# Altium project BRZ_LightLink.PrjPcb
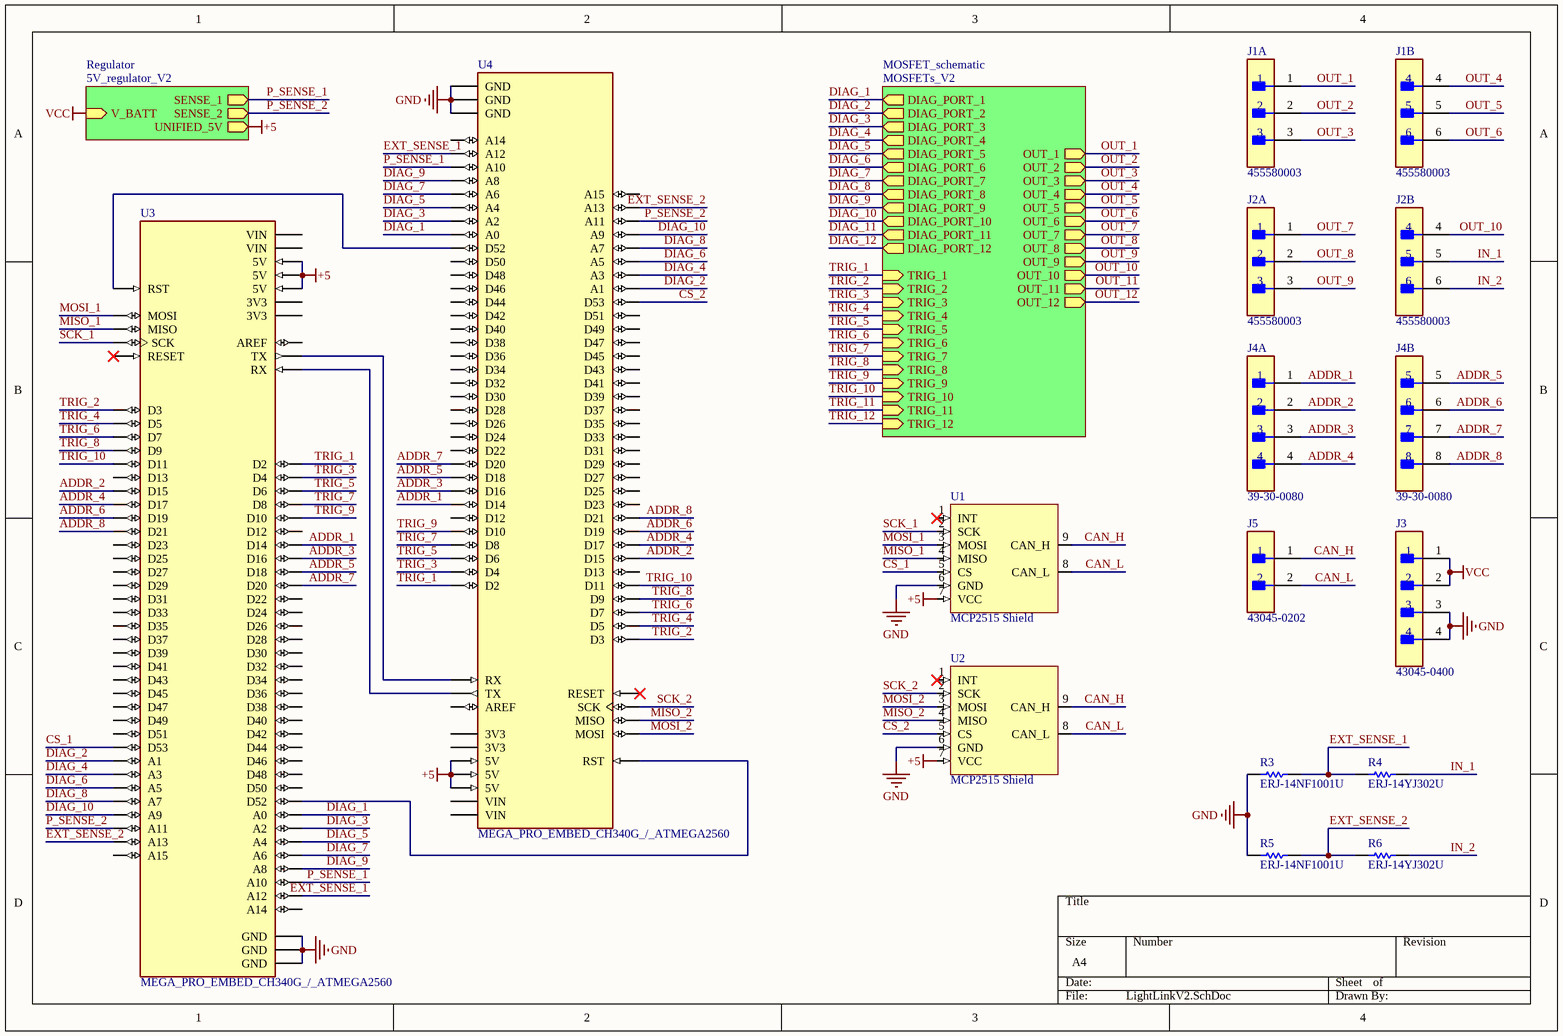
[diagram p0: LightLinkV2.SchDoc]
4 sheets, 136 parts. Net scope: hierarchical (ports join the sheet entries above them; power ports are global).
Board files: LightLinkV2.PcbDoc, LightLinkV2.1.PcbDoc, LightLinkV2.2.PcbDoc, LightLinkV3.0.PcbDoc
Sheets:
  LightLinkV2.SchDoc
    MOSFET_schematic = MOSFETs_V2.SchDoc
      Designator = MOSFET_V2.SchDoc
      Designator = MOSFET_V2.SchDoc
      Designator = MOSFET_V2.SchDoc
      Designator = MOSFET_V2.SchDoc
      Designator = MOSFET_V2.SchDoc
      Designator = MOSFET_V2.SchDoc
      Designator = MOSFET_V2.SchDoc
      Designator = MOSFET_V2.SchDoc
      Designator = MOSFET_V2.SchDoc
      Designator = MOSFET_V2.SchDoc
      Designator = MOSFET_V2.SchDoc
      Designator = MOSFET_V2.SchDoc
    Regulator = 5V_regulator_V2.SchDoc

## Sheet LightLinkV2.SchDoc
size A4; SheetNumber: 1; SheetTotal: 4

### Parts
J1  455580003  [FP-455580003-MFG]  (parts A,B of 2)
J2  455580003  [FP-455580003-MFG]  (parts A,B of 2)
J3  43045-0400  [FP-43045-0400-MFG]
J4  39-30-0080  [FP-39-30-0080-MFG]  (parts A,B of 2)
J5  43045-0202  [FP-43045-0202-MFG]
R3  ERJ-14NF1001U  [RESC3225X70X50NL20T20]
R4  ERJ-14YJ302U  [RESC3225X70X50NL20T20]
R5  ERJ-14NF1001U  [RESC3225X70X50NL20T20]
R6  ERJ-14YJ302U  [RESC3225X70X50NL20T20]
U1  MCP2515 Shield  [MCP2515 Shield-Footprint-1]
U2  MCP2515 Shield  [MCP2515 Shield-Footprint-1]
U3  MEGA_PRO_EMBED_CH340G_/_ATMEGA2560  [MODULE_MEGA_PRO_EMBED_CH340G_/_ATMEGA2560]
U4  MEGA_PRO_EMBED_CH340G_/_ATMEGA2560  [MODULE_MEGA_PRO_EMBED_CH340G_/_ATMEGA2560]

### Sub-sheets
MOSFET_schematic = MOSFETs_V2: DIAG_PORT_1 (out), TRIG_1 (in), DIAG_PORT_2 (out), TRIG_2 (in), DIAG_PORT_3 (out), TRIG_3 (in), DIAG_PORT_4 (out), TRIG_4 (in), OUT_4 (out), OUT_3 (out), OUT_2 (out), OUT_1 (out), DIAG_PORT_5 (out), TRIG_5 (in), DIAG_PORT_6 (out), TRIG_6 (in), DIAG_PORT_7 (out), TRIG_7 (in), DIAG_PORT_8 (out), TRIG_8 (in), OUT_8 (out), OUT_7 (out), OUT_6 (out), OUT_5 (out), DIAG_PORT_9 (out), TRIG_9 (in), OUT_9 (out), DIAG_PORT_10 (out), TRIG_10 (in), OUT_10 (out), DIAG_PORT_11 (out), TRIG_11 (in), DIAG_PORT_12 (out), TRIG_12 (in), OUT_11 (out), OUT_12 (out)
Regulator = 5V_regulator_V2: UNIFIED_5V (out), V_BATT (in), SENSE_1 (out), SENSE_2 (out)

### Nets
+5: U1.7(VCC) U2.7(VCC) U3.5V_1(5V) U3.5V_2(5V) U3.5V_3(5V) U4.5V_1(5V) U4.5V_2(5V) U4.5V_3(5V) ; sheet Regulator/UNIFIED_5V  [project net 5V_BUS_REGULATOR]
GND: J3.3 J3.4 R3.1 R5.1 U1.6(GND) U2.6(GND) U3.GND_1(GND) U3.GND_2(GND) U3.GND_3(GND) U4.GND_1(GND) U4.GND_2(GND) U4.GND_3(GND)
VCC: J3.1 J3.2 ; sheet Regulator/V_BATT  [project net V_IN_REGULATOR]
ADDR_1: J4.1 U3.D14 U4.D14
ADDR_2: J4.2 U3.D15 U4.D15
ADDR_3: J4.3 U3.D16 U4.D16
ADDR_4: J4.4 U3.D17 U4.D17
ADDR_5: J4.5 U3.D18 U4.D18
ADDR_6: J4.6 U3.D19 U4.D19
ADDR_7: J4.7 U3.D20 U4.D20
ADDR_8: J4.8 U3.D21 U4.D21
CAN_H: J5.1 U1.9(CAN_H) U2.9(CAN_H)
CAN_L: J5.2 U1.8(CAN_L) U2.8(CAN_L)
CS_1: U1.5(CS) U3.D53
CS_2: U2.5(CS) U4.D53
DIAG_1: U3.A0 U4.A0 ; sheet MOSFET_schematic/DIAG_PORT_1
DIAG_2: U3.A1 U4.A1 ; sheet MOSFET_schematic/DIAG_PORT_2
DIAG_3: U3.A2 U4.A2 ; sheet MOSFET_schematic/DIAG_PORT_3
DIAG_4: U3.A3 U4.A3 ; sheet MOSFET_schematic/DIAG_PORT_4
DIAG_5: U3.A4 U4.A4 ; sheet MOSFET_schematic/DIAG_PORT_5
DIAG_6: U3.A5 U4.A5 ; sheet MOSFET_schematic/DIAG_PORT_6
DIAG_7: U3.A6 U4.A6 ; sheet MOSFET_schematic/DIAG_PORT_7
DIAG_8: U3.A7 U4.A7 ; sheet MOSFET_schematic/DIAG_PORT_8
DIAG_9: U3.A8 U4.A8 ; sheet MOSFET_schematic/DIAG_PORT_9
DIAG_10: U3.A9 U4.A9 ; sheet MOSFET_schematic/DIAG_PORT_10
EXT_SENSE_1: R3.2 R4.1 U3.A12 U4.A12
EXT_SENSE_2: R5.2 R6.1 U3.A13 U4.A13
IN_1: J2.5 R4.2
IN_2: J2.6 R6.2
MISO_1: U1.4(MISO) U3.MISO
MISO_2: U2.4(MISO) U4.MISO
MOSI_1: U1.3(MOSI) U3.MOSI
MOSI_2: U2.3(MOSI) U4.MOSI
OUT_1: J1.1 ; sheet MOSFET_schematic/OUT_1
OUT_2: J1.2 ; sheet MOSFET_schematic/OUT_2
OUT_3: J1.3 ; sheet MOSFET_schematic/OUT_3
OUT_4: J1.4 ; sheet MOSFET_schematic/OUT_4
OUT_5: J1.5 ; sheet MOSFET_schematic/OUT_5
OUT_6: J1.6 ; sheet MOSFET_schematic/OUT_6
OUT_7: J2.1 ; sheet MOSFET_schematic/OUT_7
OUT_8: J2.2 ; sheet MOSFET_schematic/OUT_8
OUT_9: J2.3 ; sheet MOSFET_schematic/OUT_9
OUT_10: J2.4 ; sheet MOSFET_schematic/OUT_10
P_SENSE_1: U3.A10 U4.A10 ; sheet Regulator/SENSE_1
P_SENSE_2: U3.A11 U4.A11 ; sheet Regulator/SENSE_2
SCK_1: U1.2(SCK) U3.SCK
SCK_2: U2.2(SCK) U4.SCK
TRIG_1: U3.D2 U4.D2 ; sheet MOSFET_schematic/TRIG_1
TRIG_2: U3.D3 U4.D3 ; sheet MOSFET_schematic/TRIG_2
TRIG_3: U3.D4 U4.D4 ; sheet MOSFET_schematic/TRIG_3
TRIG_4: U3.D5 U4.D5 ; sheet MOSFET_schematic/TRIG_4
TRIG_5: U3.D6 U4.D6 ; sheet MOSFET_schematic/TRIG_5
TRIG_6: U3.D7 U4.D7 ; sheet MOSFET_schematic/TRIG_6
TRIG_7: U3.D8 U4.D8 ; sheet MOSFET_schematic/TRIG_7
TRIG_8: U3.D9 U4.D9 ; sheet MOSFET_schematic/TRIG_8
TRIG_9: U3.D10 U4.D10 ; sheet MOSFET_schematic/TRIG_9
TRIG_10: U3.D11 U4.D11 ; sheet MOSFET_schematic/TRIG_10
NetU3_D52: U3.D52 U4.RST
NetU3_RST: U3.RST U4.D52
NetU3_RX: U3.RX U4.TX
NetU3_TX: U3.TX U4.RX

Not connected (* = marked no-connect by the designer): U1 1(INT)*; U2 1(INT)*; U3 3V3_1(3V3) 3V3_2(3V3) A14 A15 AREF D12 D13 D22 D23 D24 D25 D26 D27 D28 D29 D30 D31 D32 D33 D34 D35 D36 D37 D38 D39 D40 D41 D42 D43 D44 D45 D46 D47 D48 D49 D50 D51 RESET* VIN_1(VIN) VIN_2(VIN); U4 3V3_1(3V3) 3V3_2(3V3) A14 A15 AREF D12 D13 D22 D23 D24 D25 D26 D27 D28 D29 D30 D31 D32 D33 D34 D35 D36 D37 D38 D39 D40 D41 D42 D43 D44 D45 D46 D47 D48 D49 D50 D51 RESET* VIN_1(VIN) VIN_2(VIN)

### Library data of the parts
J1 J2 = CMP-04776-000024-1: CONN HEADER R/A 6POS 4.2MM; Manufacturer: Molex; Standoff Height: 0.4mm; Conn Orientation: Right Angle; Number Of Contacts: 6; Conn Gender: Male; Voltage Rating: 600V; Current Rating: 8A; Footprint Url: https://www.molex.com/pdm_docs/sd/455580003_sd.pdf; Number Of Rows: 2; Lead Free: Yes; Digikey Description: CONN HEADER R/A 6POS 4.2MM; ComponentLink2URL: https://www.molex.com/webdocs/datasheets/pdf/en-us/0455580003_PCB_HEADERS.pdf; Octopart: https://octopart.com/45558-0003-molex-7672845; Package: 0; Device Class L3: unset; ComponentLink2Description: Datasheet; Device Class L2: Headers and Wire Housings; Category: Conn; Contact Material: Tin,Nickel; Mouser Description: Conn Power HDR 6 POS 4.2mm Solder ST Thru-Hole 6 Terminal 1 Port Mini-Fit Jr™ Tray; Manufacturer Part Number: 455580003; Pitch: 4.2mm; Device Class L1: Connectors; Temperature Range Low: -40°C; Temperature: -40°C to +105°C; RoHS: TRUE; Temperature Range High: +105°C; Height: 10.38mm; Automotive: No
J3 = CMP-04776-000002-1: CONN HEADER R/A 4POS 3MM; Manufacturer: Molex; Conn Gender: Male; Conn Orientation: Right Angle; Voltage Rating: 600V; Number Of Contacts: 4; Is Female: yes; Current Rating: 8.5A; ComponentLink2URL: https://www.molex.com/webdocs/datasheets/pdf/en-us/0430450400_PCB_HEADERS.pdf; Manufacturer Part Number: 43045-0400; Digikey Description: CONN HEADER R/A 4POS 3MM; Category: Conn; Temperature Range High: +105°C; Lead Free: Yes; Device Class L1: Connectors; Automotive: No; Temperature: -40°C to +105°C; Footprint Url: https://www.molex.com/pdm_docs/sd/430450400_sd.pdf; Height: 9.27mm; Number Of Rows: 2; Device Class L3: unset; Pitch: 3mm; Temperature Range Low: -40°C; Contact Material: Tin,Nickel; Octopart: https://octopart.com/43045-0400-molex-287063; RoHS: TRUE; ComponentLink2Description: Datasheet; Package: 43045-0400; Device Class L2: Headers and Wire Housings
J4 = CMP-04776-000387-1: CONN HEADER R/A 8POS 4.2MM; Number of Contacts: 8; Max Voltage Rating (AC): 600V; Insulation Resistance: 1GR; Contact Resistance: 10mR; Max Current Rating: 7A; Gender: Male; Row Spacing: 0.165inch; Approvals: UL; Number of Ports: 1; Current Rating: 13A; Glow Wire Compliant: Non-compliant; Pitch: 4.2mm; Housing Material: Nylon; Color: Natural; Max Operating Temperature: 105°C; Packaging: Bag; Termination: Solder; Flammability Rating: UL94 V-0; Width: 11.4mm; Contact Plating: Tin; Material: Nylon; Mount: Through Hole; Height: 11.4mm; Halogen Free: Low Halogen; Depth: 19.4mm; ELV: Compliant; Number of Terminals/Pins: 8; Orientation: Right Angle; Number of Positions: 8; Contact Material: Brass; Number of Rows: 2; Lead Free: Lead Free; Contact Type: Male Pin; Min Operating Temperature: -40°C; Fastening Type: Ramp; Package Quantity: 225; Voltage Rating (DC): 600V; Number of Circuits: 8; Housing Color: Natural; Voltage Rating: 600V; Series: Mini-Fit® Jr™ 5569; Contact Gender: Male; Length: 18mm
J5 = CMP-04776-000660-1: CONN HEADER R/A 2POS; Number of Contacts: 2; Current Rating: 5A; Gender: Male; Contact Resistance: 10mR; Voltage Rating (DC): 250V; Glow Wire Compliant: Compliant; Voltage Rating: 600V; Pitch: 3mm; Max Voltage Rating (DC): 250.25kV; Insulation Resistance: 1GR; Radiation Hardening: No; Halogen Free: Low Halogen; Number of Positions: 2; Mount: Through Hole; RoHS Compliant: Yes; Lead Free: Contains Lead; Color: Black; Max Current Rating: 5A; Length: 7.15mm; Orientation: Right Angle; Termination: Solder; Height: 8.77mm; Flammability Rating: UL94 V-0; Diameter: 3mm; Min Operating Temperature: -40°C; Series: Micro-Fit 3.0; Max Operating Temperature: 105°C; Number of Circuits: 2; Number of Rows: 2; Depth: 12.2mm; Housing Color: Black; Contact Plating: Gold; Case/Package: SMC; Contact Material: Brass; Packaging: Tray; Housing Material: Thermoplastic; Package Quantity: 3168
R3 R5 = CMP-2005-01957-1: Manufacturer: Panasonic; Part Number: ERJ-14NF1001U
R4 R6 = CMP-2005-03553-1: Manufacturer: Panasonic; Part Number: ERJ-14YJ302U
U1 U2 = CMP-015-00008-2: PCB layout of Arduino MCP2515 shield to avoid remaking the schematic and ordering individual components when I already have a dozen shields on hand.
U3 U4 = CMP-002-000002-2: Mega 2560 PRO (Embed) CH340G/ATmega2560-16AU; Component Type: Standard; Design Item ID: MEGA_PRO_EMBED_CH340G_/_ATMEGA2560; Price: None; Pin Count: 86; Source: MEGA_PRO_EMBED_CH340G___ATMEGA2560.SchLib; Value: *; Availability: Unavailable; MP: MEGA_PRO_EMBED_CH340G_/_ATMEGA2560; Package: None

## Sheet MOSFETs_V2.SchDoc
size A4; SheetNumber: 2; SheetTotal: 4
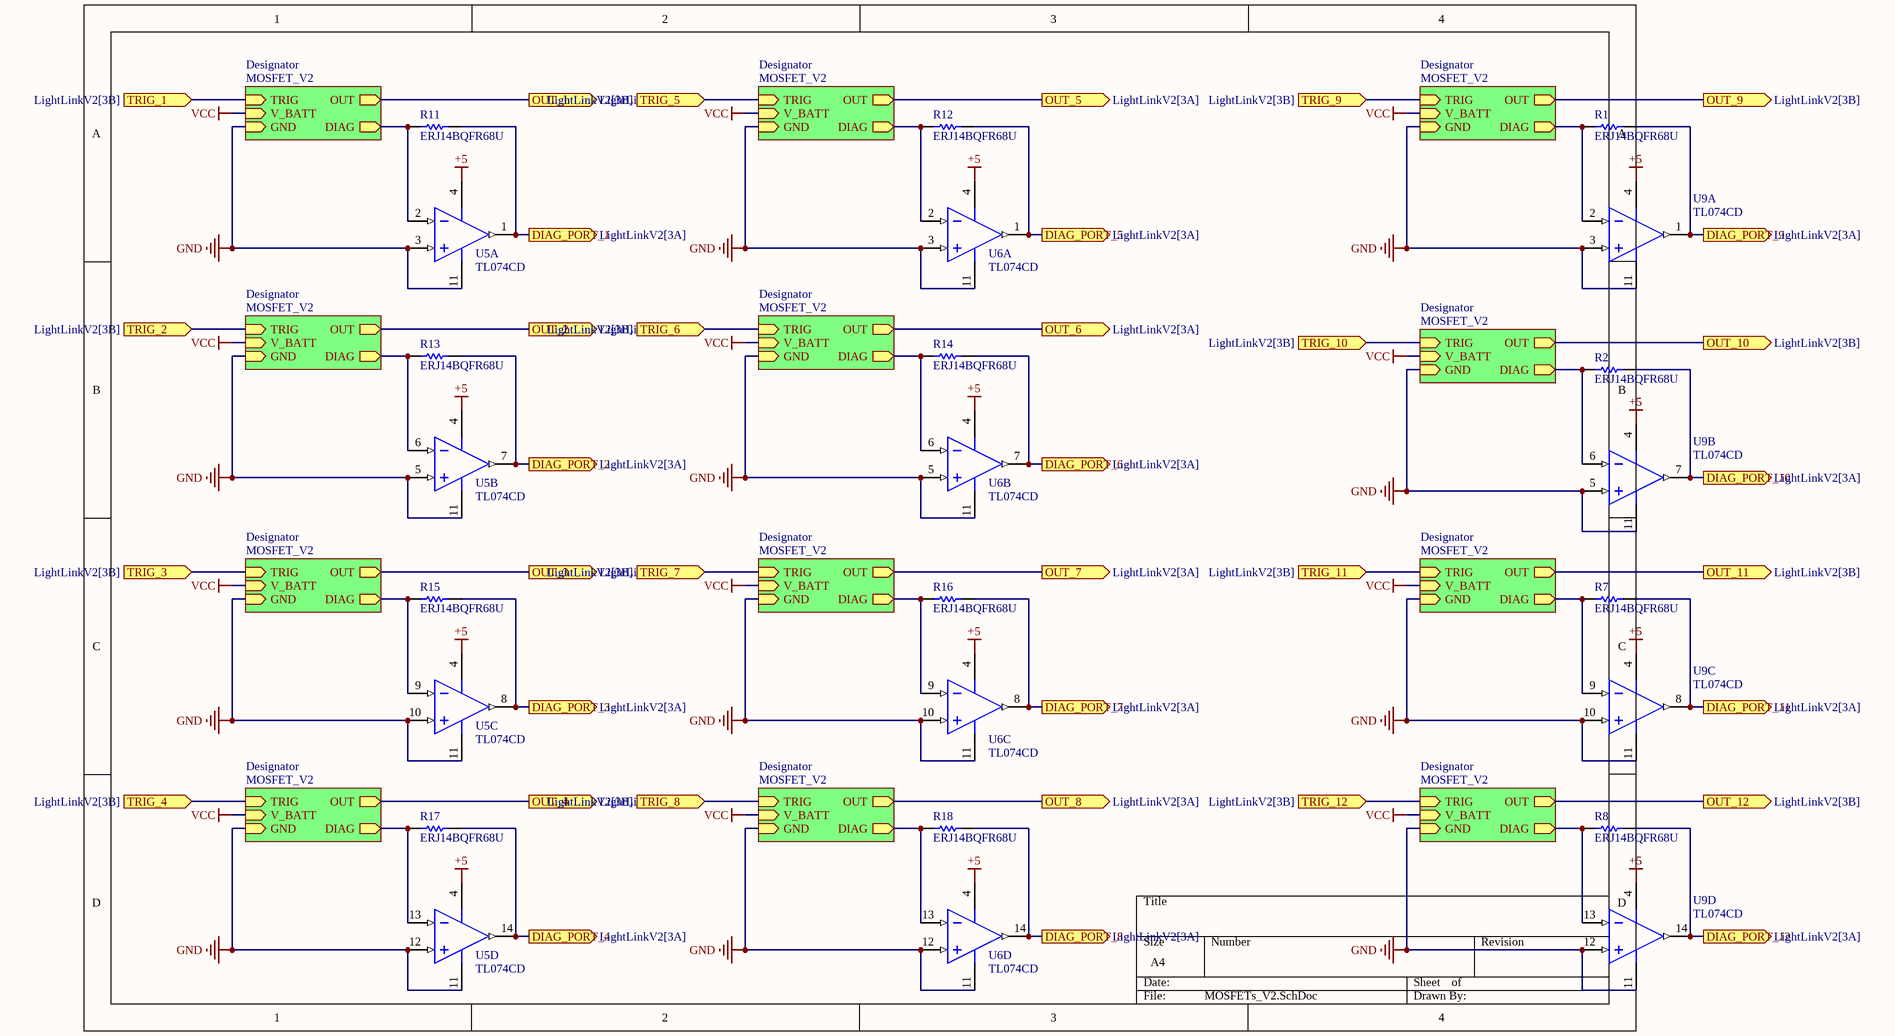
[diagram p1: MOSFETs_V2.SchDoc]

### Parts
R1  ERJ14BQFR68U  [RESC3225X70X50LL20T20]
R2  ERJ14BQFR68U  [RESC3225X70X50LL20T20]
R7  ERJ14BQFR68U  [RESC3225X70X50LL20T20]
R8  ERJ14BQFR68U  [RESC3225X70X50LL20T20]
R11  ERJ14BQFR68U  [RESC3225X70X50LL20T20]
R12  ERJ14BQFR68U  [RESC3225X70X50LL20T20]
R13  ERJ14BQFR68U  [RESC3225X70X50LL20T20]
R14  ERJ14BQFR68U  [RESC3225X70X50LL20T20]
R15  ERJ14BQFR68U  [RESC3225X70X50LL20T20]
R16  ERJ14BQFR68U  [RESC3225X70X50LL20T20]
R17  ERJ14BQFR68U  [RESC3225X70X50LL20T20]
R18  ERJ14BQFR68U  [RESC3225X70X50LL20T20]
U5  TL074CD  [D0014A_M]  (parts A,B,C,D of 4)
U6  TL074CD  [D0014A_M]  (parts A,B,C,D of 4)
U9  TL074CD  [D0014A_M]  (parts A,B,C,D of 4)

### Sub-sheets
Designator = MOSFET_V2: TRIG (in), V_BATT (in), OUT (out), DIAG (out), GND (in)
Designator = MOSFET_V2: TRIG (in), V_BATT (in), OUT (out), DIAG (out), GND (in)
Designator = MOSFET_V2: TRIG (in), V_BATT (in), OUT (out), DIAG (out), GND (in)
Designator = MOSFET_V2: TRIG (in), V_BATT (in), OUT (out), DIAG (out), GND (in)
Designator = MOSFET_V2: TRIG (in), V_BATT (in), OUT (out), DIAG (out), GND (in)
Designator = MOSFET_V2: TRIG (in), V_BATT (in), OUT (out), DIAG (out), GND (in)
Designator = MOSFET_V2: TRIG (in), V_BATT (in), OUT (out), DIAG (out), GND (in)
Designator = MOSFET_V2: TRIG (in), V_BATT (in), OUT (out), DIAG (out), GND (in)
Designator = MOSFET_V2: TRIG (in), V_BATT (in), OUT (out), DIAG (out), GND (in)
Designator = MOSFET_V2: TRIG (in), V_BATT (in), OUT (out), DIAG (out), GND (in)
Designator = MOSFET_V2: TRIG (in), V_BATT (in), OUT (out), DIAG (out), GND (in)
Designator = MOSFET_V2: TRIG (in), V_BATT (in), OUT (out), DIAG (out), GND (in)

### Ports
DIAG_PORT_1 (out, see LightLinkV2[3A]), DIAG_PORT_2 (out, see LightLinkV2[3A]), DIAG_PORT_3 (out, see LightLinkV2[3A]), DIAG_PORT_4 (out, see LightLinkV2[3A]), DIAG_PORT_5 (out, see LightLinkV2[3A]), DIAG_PORT_6 (out, see LightLinkV2[3A]), DIAG_PORT_7 (out, see LightLinkV2[3A]), DIAG_PORT_8 (out, see LightLinkV2[3A]), DIAG_PORT_9 (out, see LightLinkV2[3A]), DIAG_PORT_10 (out, see LightLinkV2[3A]), DIAG_PORT_11 (out, see LightLinkV2[3A]), DIAG_PORT_12 (out, see LightLinkV2[3A]), OUT_1 (out, see LightLinkV2[3A]), OUT_2 (out, see LightLinkV2[3A]), OUT_3 (out, see LightLinkV2[3A]), OUT_4 (out, see LightLinkV2[3A]), OUT_5 (out, see LightLinkV2[3A]), OUT_6 (out, see LightLinkV2[3A]), OUT_7 (out, see LightLinkV2[3A]), OUT_8 (out, see LightLinkV2[3A]), OUT_9 (out, see LightLinkV2[3B]), OUT_10 (out, see LightLinkV2[3B]), OUT_11 (out, see LightLinkV2[3B]), OUT_12 (out, see LightLinkV2[3B]), TRIG_1 (in, see LightLinkV2[3B]), TRIG_2 (in, see LightLinkV2[3B]), TRIG_3 (in, see LightLinkV2[3B]), TRIG_4 (in, see LightLinkV2[3B]), TRIG_5 (in, see LightLinkV2[3B]), TRIG_6 (in, see LightLinkV2[3B]), TRIG_7 (in, see LightLinkV2[3B]), TRIG_8 (in, see LightLinkV2[3B]), TRIG_9 (in, see LightLinkV2[3B]), TRIG_10 (in, see LightLinkV2[3B]), TRIG_11 (in, see LightLinkV2[3B]), TRIG_12 (in, see LightLinkV2[3B])

### Nets
+5: U5.4(VCC+) U6.4(VCC+) U9.4(VCC+)  [project net 5V_BUS_REGULATOR]
GND: U5.3(IN1+) U5.5(IN2+) U5.10(IN3+) U5.11(VCC-) U5.12(IN4+) U6.3(IN1+) U6.5(IN2+) U6.10(IN3+) U6.11(VCC-) U6.12(IN4+) U9.3(IN1+) U9.5(IN2+) U9.10(IN3+) U9.11(VCC-) U9.12(IN4+) ; sheet Designator/GND, sheet Designator/GND, sheet Designator/GND, sheet Designator/GND, sheet Designator/GND, sheet Designator/GND, sheet Designator/GND, sheet Designator/GND, sheet Designator/GND, sheet Designator/GND, sheet Designator/GND, sheet Designator/GND
VCC: sheet Designator/V_BATT, sheet Designator/V_BATT, sheet Designator/V_BATT, sheet Designator/V_BATT, sheet Designator/V_BATT, sheet Designator/V_BATT, sheet Designator/V_BATT, sheet Designator/V_BATT, sheet Designator/V_BATT, sheet Designator/V_BATT, sheet Designator/V_BATT, sheet Designator/V_BATT  [project net V_IN_REGULATOR]
DIAG_1: R11.2 U5.1(OUT1) ; port DIAG_PORT_1
DIAG_2: R13.2 U5.7(OUT2) ; port DIAG_PORT_2
DIAG_3: R15.2 U5.8(OUT3) ; port DIAG_PORT_3
DIAG_4: R17.2 U5.14(OUT4) ; port DIAG_PORT_4
DIAG_5: R12.2 U6.1(OUT1) ; port DIAG_PORT_5
DIAG_6: R14.2 U6.7(OUT2) ; port DIAG_PORT_6
DIAG_7: R16.2 U6.8(OUT3) ; port DIAG_PORT_7
DIAG_8: R18.2 U6.14(OUT4) ; port DIAG_PORT_8
DIAG_9: R1.2 U9.1(OUT1) ; port DIAG_PORT_9
DIAG_10: R2.2 U9.7(OUT2) ; port DIAG_PORT_10
DIAG_11: R7.2 U9.8(OUT3) ; port DIAG_PORT_11
DIAG_12: R8.2 U9.14(OUT4) ; port DIAG_PORT_12
OUT_1: port OUT_1, sheet Designator/OUT
OUT_2: port OUT_2, sheet Designator/OUT
OUT_3: port OUT_3, sheet Designator/OUT
OUT_4: port OUT_4, sheet Designator/OUT
OUT_5: port OUT_5, sheet Designator/OUT
OUT_6: port OUT_6, sheet Designator/OUT
OUT_7: port OUT_7, sheet Designator/OUT
OUT_8: port OUT_8, sheet Designator/OUT
OUT_9: port OUT_9, sheet Designator/OUT
OUT_10: port OUT_10, sheet Designator/OUT
OUT_11: port OUT_11, sheet Designator/OUT
OUT_12: port OUT_12, sheet Designator/OUT
TRIG_1: port TRIG_1, sheet Designator/TRIG
TRIG_2: port TRIG_2, sheet Designator/TRIG
TRIG_3: port TRIG_3, sheet Designator/TRIG
TRIG_4: port TRIG_4, sheet Designator/TRIG
TRIG_5: port TRIG_5, sheet Designator/TRIG
TRIG_6: port TRIG_6, sheet Designator/TRIG
TRIG_7: port TRIG_7, sheet Designator/TRIG
TRIG_8: port TRIG_8, sheet Designator/TRIG
TRIG_9: port TRIG_9, sheet Designator/TRIG
TRIG_10: port TRIG_10, sheet Designator/TRIG
TRIG_11: port TRIG_11, sheet Designator/TRIG
TRIG_12: port TRIG_12, sheet Designator/TRIG
NetR1_1: R1.1 U9.2(IN1-) ; sheet Designator/DIAG
NetR2_1: R2.1 U9.6(IN2-) ; sheet Designator/DIAG
NetR7_1: R7.1 U9.9(IN3-) ; sheet Designator/DIAG
NetR8_1: R8.1 U9.13(IN4-) ; sheet Designator/DIAG
NetR11_1: R11.1 U5.2(IN1-) ; sheet Designator/DIAG
NetR12_1: R12.1 U6.2(IN1-) ; sheet Designator/DIAG
NetR13_1: R13.1 U5.6(IN2-) ; sheet Designator/DIAG
NetR14_1: R14.1 U6.6(IN2-) ; sheet Designator/DIAG
NetR15_1: R15.1 U5.9(IN3-) ; sheet Designator/DIAG
NetR16_1: R16.1 U6.9(IN3-) ; sheet Designator/DIAG
NetR17_1: R17.1 U5.13(IN4-) ; sheet Designator/DIAG
NetR18_1: R18.1 U6.13(IN4-) ; sheet Designator/DIAG

### Library data of the parts
R1 R2 R7 R8 R11-R18 = CMP-2005-03807-1: Manufacturer: Panasonic; Part Number: ERJ14BQFR68U
U5 U6 U9 = CMP-0017-00005-2: Quad Low-Noise JFET-Input General-Purpose Operational Amplifier, 7 to 36 V, 0 to 70 degC, 14-pin SOIC (D14), Green (RoHS & no Sb/Br); Manufacturer: Texas Instruments; Iq per channel(Max)(mA): 2.5; CMRR(Min)(dB): 70; Offset Drift(Typ)(uV/C): 18; Slew Rate(Typ)(V/us): 13; Rating: Military; Number of Channels: 4; Total Supply Voltage(Min)(+5V is 5, +/-5V is 10): 7; Sub Family: General Purpose Amplifier, High Supply Voltage Amplifier (>=30V); IIB(Max)(pA): 200; Total Supply Voltage(Max)(+5V is 5, +/-5V is 10): 36; Vio (25C)(Max)(mV): 10; GBW(Typ)(MHz): 3; ComponentLink1Description: Manufacturer URL; ComponentLink2Description: Datasheet; PackageDescription: 14-Pin Plastic Small Outline, Body 8.65 x 3.90 mm, Pitch 1.27 mm; Mounting Technology: Surface Mount; ComponentLink2URL: http://www.ti.com/lit/ds/symlink/tl074.pdf; PartNumber: TL074CD; Vn at 1kHz(Typ)(nV/rtHz): 18; Eco-Plan: Green (RoHS & no Sb/Br); ComponentLink1URL: http://www.ti.com/; PackageVersion: 4040047-5/M, 06/2011; ComponentLink3Description: Package Specification; DatasheetVersion: SLOS080J; Code_JEDEC: MS-012; PackageReference: D0014A; ComponentLink3URL: http://www.ti.com/lit/ml/mpds177g/mpds177g.pdf

## Sheet MOSFET_V2.SchDoc
size A4; SheetNumber: 3; SheetTotal: 4
Used 12 times, as channels MOSFET_schematic/Designator, MOSFET_schematic/Designator, MOSFET_schematic/Designator, MOSFET_schematic/Designator, MOSFET_schematic/Designator, MOSFET_schematic/Designator, MOSFET_schematic/Designator, MOSFET_schematic/Designator, MOSFET_schematic/Designator, MOSFET_schematic/Designator, MOSFET_schematic/Designator, MOSFET_schematic/Designator. Parts and nets are listed once, with the designators drawn on the sheet.
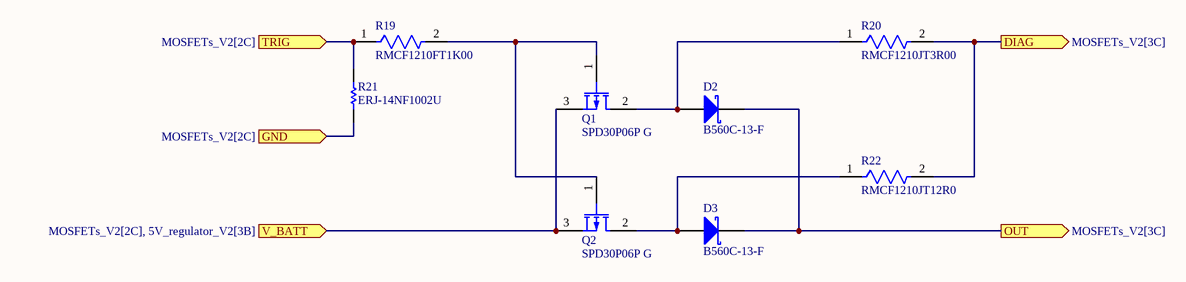
[diagram p2: MOSFET_V2.SchDoc]

### Parts
D2  B560C-13-F  [DIOD-B5X0C-2_M]
D3  B560C-13-F  [DIOD-B5X0C-2_M]
Q1  SPD30P06P G  [INF-PG-TO252-3-1_N]
Q2  SPD30P06P G  [INF-PG-TO252-3-1_N]
R19  RMCF1210FT1K00  [FP-RMCF1210-IPC_A]
R20  RMCF1210JT3R00  [FP-RMCF1210-IPC_A]
R21  ERJ-14NF1002U  [RESC3225X70X50NL20T20]
R22  RMCF1210JT12R0  [FP-RMCF1210-IPC_B]

### Ports
DIAG (out, see MOSFETs_V2[3C]), GND (in, see MOSFETs_V2[2C]), OUT (out, see MOSFETs_V2[3C]), TRIG (in, see MOSFETs_V2[2C]), V_BATT (in, see MOSFETs_V2[2C], 5V_regulator_V2[3B])

### Nets
DIAG: R20.2 R22.2 ; port DIAG
GND: R21.2 ; port GND
OUT: D2.1(K) D3.1(K) ; port OUT
TRIG: R19.1 R21.1 ; port TRIG
V_BATT: Q1.3(S) Q2.3(S) ; port V_BATT
NetD2_2: D2.2(A) Q1.2(D) R20.1
NetD3_2: D3.2(A) Q2.2(D) R22.1
NetQ1_1: Q1.1(G) Q2.1(G) R19.2

### Channels
MOSFET_schematic/Designator: designators end in _Designator10; ports DIAG=NetR11_1 GND=GND OUT=OUT_1 TRIG=TRIG_1 V_BATT=V_IN_REGULATOR
MOSFET_schematic/Designator: designators end in _Designator9; ports DIAG=NetR13_1 GND=GND OUT=OUT_2 TRIG=TRIG_2 V_BATT=V_IN_REGULATOR
MOSFET_schematic/Designator: designators end in _Designator8; ports DIAG=NetR15_1 GND=GND OUT=OUT_3 TRIG=TRIG_3 V_BATT=V_IN_REGULATOR
MOSFET_schematic/Designator: designators end in _Designator7; ports DIAG=NetR17_1 GND=GND OUT=OUT_4 TRIG=TRIG_4 V_BATT=V_IN_REGULATOR
MOSFET_schematic/Designator: designators end in _Designator6; ports DIAG=NetR12_1 GND=GND OUT=OUT_5 TRIG=TRIG_5 V_BATT=V_IN_REGULATOR
MOSFET_schematic/Designator: designators end in _Designator5; ports DIAG=NetR14_1 GND=GND OUT=OUT_6 TRIG=TRIG_6 V_BATT=V_IN_REGULATOR
MOSFET_schematic/Designator: designators end in _Designator4; ports DIAG=NetR16_1 GND=GND OUT=OUT_7 TRIG=TRIG_7 V_BATT=V_IN_REGULATOR
MOSFET_schematic/Designator: designators end in _Designator3; ports DIAG=NetR18_1 GND=GND OUT=OUT_8 TRIG=TRIG_8 V_BATT=V_IN_REGULATOR
MOSFET_schematic/Designator: designators end in _Designator2; ports DIAG=NetR1_1 GND=GND OUT=OUT_9 TRIG=TRIG_9 V_BATT=V_IN_REGULATOR
MOSFET_schematic/Designator: designators end in _Designator1; ports DIAG=NetR2_1 GND=GND OUT=OUT_10 TRIG=TRIG_10 V_BATT=V_IN_REGULATOR
MOSFET_schematic/Designator: designators end in _Designator11; ports DIAG=NetR7_1 GND=GND OUT=OUT_11 TRIG=TRIG_11 V_BATT=V_IN_REGULATOR
MOSFET_schematic/Designator: designators end in _Designator12; ports DIAG=NetR8_1 GND=GND OUT=OUT_12 TRIG=TRIG_12 V_BATT=V_IN_REGULATOR

### Library data of the parts
D2 D3 = CMP-2000-05098-2: Schottky Barrier Rectifier, 5 A, 60 V, -55 to 125 degC, 2-Pin SMD, RoHS, Tape and Reel; Ir - Reverse Current: 500uA; Configuration: Single; Ifsm - Forward Surge Current: 100A; Vrrm - Repetitive Reverse Voltage: 60V; Brand: DiodesIncorporated; Vf - Forward Voltage: 0.7V; If - Forward Current: 5A; Unit Weight: 0.007408oz; Type: SchottkyBarrierRectifier; Package / Case: SMC; Manufacturer URL: http://www.diodes.com/; Datasheet URL: https://datasheet.ciiva.com/27052/1538961-27052355.pdf; Factory Pack Quantity: 3000; Height: 2.5mm; Width: 6.22mm; Product Category: SchottkyDiodes&Rectifiers; Minimum Operating Temperature: -55C; Manufacturer: DiodesIncorporated; Datasheet Version: Rev. 7-2, 06/2007; Product: SchottkyDiodes; Maximum Operating Temperature: +125C; Operating Temperature Range: -55Cto+125C; Technology: Si; Length: 7.11mm; RoHS: True; Packaging: Reel; Termination Style: SMD/SMT; Series: B560; Mounting Style: SMD/SMT
Q1 Q2 = CMP-1099-00058-1: P-Channel SIPMOS Power-Transistor, -60 V VDS, -30 A ID, -55 to 175 degC, PG-TO252-3-1, Reel, Green; Manufacturer: Infineon; Pto t (max): 125Â W; RDS (on) (max): 75Â mOhm; VGS(th) (max): -4Â V; Green: TRUE; ID (max): -30Â A; QG: 32Â nC; VDS (max): -60Â V; VGS(th) (min): -2.1Â V; RthJC (max): 1.2Â K/W; IDpuls (max): -120Â A; ComponentLink1Description: Manufacturer URL; Packing: Reel; ComponentLink2Description: Datasheet; ComponentLink1URL: http://www.infineon.com/; ComponentLink3Description: Package Specification; PackageDescription: 3-Pin Plastic (Green) Transistor Single Outline Package, 6.5 x 6.12 mm Body, 2.28 mm Pitch; Mounting Technology: Surface Mount; ComponentLink3URL: http://www.infineon.com/dgdl/TLE42744_DS_11.pdf?folderId=db3a304318f3fe290118f5a433570040&fileId=db3a304327b897500128012ccafe37d2&sId=db3a30443d67b5ca013d83f7c0ea327b; Rth: 1.2Â K/W; ComponentLink2URL: http://www.infineon.com/dgdl/SPD30P06P_Rev.2.3_pdf.pdf?folderId=db3a30431ed1d7b2011f4042f2ff4ec5&fileId=db3a30431ed1d7b2011f404fbc7e4ef4; PartNumber: SPD30P06P G; PackageReference: PG-TO252-3-1; DatasheetVersion: Rev. 2.3; PackageVersion: Jan-10
R19 = CMP-26527-007195-1: 1kΩ ±1% 0.5W 1210 Thick Film Chip Resistor AEC-Q200 compliant; Max Power Dissipation: 333mW; Temperature Coefficient: 100ppm/°C; Resistance: 1kR; Lead Free: Lead Free; Radiation Hardening: No; Min Operating Temperature: -55°C; RoHS Compliant: Yes; Length: 3.2mm; Height: 0.028inch; Contact Plating: Tin; Resistor Type: Thick Film; Case Code (Metric): 3225; Case Code (Imperial): 1210; Military Standard: Not; Tolerance: 1%; Series: RMCF; Features: Automotive AEC-Q200; Case/Package: 1210; Max Operating Temperature: 155°C; Construction: Rectangular; Number of Terminations: 2; Width: 0.098inch; Depth: 2.5mm; Mount: Surface Mount; Packaging: Tape and Reel
R20 = CMP-26527-000722-1: 3Ω ±5% 0.5W 1210 Thick Film Chip Resistor AEC-Q200 compliant; Temperature Coefficient: 400ppm/°C; Max Power Dissipation: 500mW; Resistance: 3R; Length: 0.126inch; Case/Package: 1210; Mount: Surface Mount; Resistor Type: Thick Film; Radiation Hardening: No; Tolerance: 5%; Min Operating Temperature: -55°C; Features: Automotive AEC-Q200; Max Operating Temperature: 155°C; Contact Plating: Tin; Series: RMCF; Case Code (Metric): 3225; Number of Terminations: 2; Height: 0.028inch; RoHS Compliant: Yes; Case Code (Imperial): 1210; Packaging: Tape and Reel; Width: 0.098inch
R21 = CMP-1015-00623-2: Manufacturer: Panasonic; Part Number: ERJ-14NF1002U
R22 = CMP-26527-003986-1: 12Ω ±5% 0.5W 1210 Thick Film Chip Resistor AEC-Q200 compliant; Temperature Coefficient: 200ppm/°C; Max Power Dissipation: 500mW; Resistance: 12R; Resistor Type: Thick Film; Case/Package: 1210; Tolerance: 5%; Length: 0.126inch; Height: 0.028inch; Contact Plating: Tin; Width: 0.098inch; Mount: Surface Mount; Radiation Hardening: No; Number of Terminations: 2; Min Operating Temperature: -55°C; Series: RMCF; Packaging: Tape and Reel; RoHS Compliant: Yes; Max Operating Temperature: 155°C; Features: Automotive AEC-Q200

## Sheet 5V_regulator_V2.SchDoc
size A4; SheetNumber: 4; SheetTotal: 4
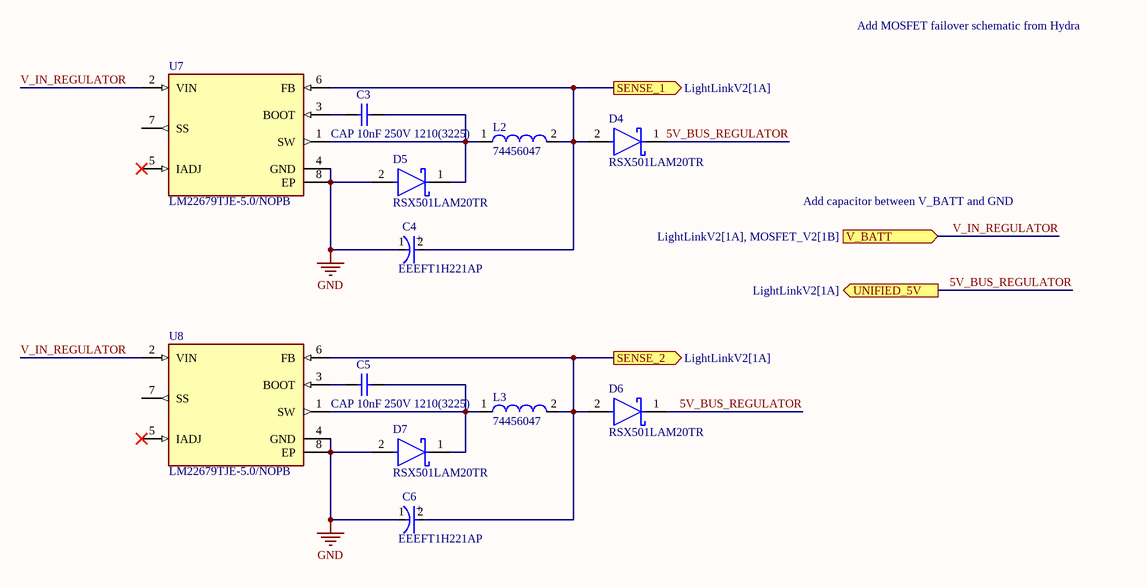
[diagram p3: 5V_regulator_V2.SchDoc]

### Parts
C3  CAP 10nF 250V 1210(3225)  [CAPC1210(3225)100_N]
C4  EEEFT1H221AP  [FP-FTF-MFG]
C5  CAP 10nF 250V 1210(3225)  [CAPC1210(3225)100_N]
C6  EEEFT1H221AP  [FP-FTF-MFG]
D4  RSX501LAM20TR  [FP-PMDTM-MFG]
D5  RSX501LAM20TR  [FP-PMDTM-MFG]
D6  RSX501LAM20TR  [FP-PMDTM-MFG]
D7  RSX501LAM20TR  [FP-PMDTM-MFG]
L2  74456047  [WE-PD4-L]
L3  74456047  [WE-PD4-L]
U7  LM22679TJE-5.0/NOPB  [FP-NDR0007A-MFG]
U8  LM22679TJE-5.0/NOPB  [FP-NDR0007A-MFG]

### Ports
SENSE_1 (out, see LightLinkV2[1A]), SENSE_2 (out, see LightLinkV2[1A]), UNIFIED_5V (out, see LightLinkV2[1A]), V_BATT (in, see LightLinkV2[1A], MOSFET_V2[1B])

### Nets
5V_BUS_REGULATOR: D4.1(C) D6.1(C) ; port UNIFIED_5V
GND: C4.1(C) C6.1(C) D5.2(A) D7.2(A) U7.4(GND) U7.8(EP) U8.4(GND) U8.8(EP)
V_IN_REGULATOR: U7.2(VIN) U8.2(VIN) ; port V_BATT
P_SENSE_1: C4.2(A) D4.2(A) L2.2 U7.6(FB) ; port SENSE_1
P_SENSE_2: C6.2(A) D6.2(A) L3.2 U8.6(FB) ; port SENSE_2
NetC3_1: C3.1 U7.3(BOOT)
NetC3_2: C3.2 D5.1(C) L2.1 U7.1(SW)
NetC5_1: C5.1 U8.3(BOOT)
NetC5_2: C5.2 D7.1(C) L3.1 U8.1(SW)

Not connected (* = marked no-connect by the designer): U7 5(IADJ)* 7(SS); U8 5(IADJ)* 7(SS)

### Notes on the sheet
- Add MOSFET failover schematic from Hydra
- Add capacitor between V_BATT and GND
- (in symbol CMP-05427-000092-1) +

### Library data of the parts
C3 C5 = CMP-1038-01142-1: CAP 10nF 250V ±10% 1210 (3225 Metric) Thickness 1mm SMD; Case-EIA: 1210; Case-Metric: 3225; Tolerance: Â±10%; Rated Voltage: 250 V; Max Thickness: 1 mm; Value: 10nF; Technology: SMT
C4 C6 = CMP-05427-000092-1: CAP ALUM 220UF 20% 50V SMD; Ripple Current (AC): 670mA; Dielectric Material: Aluminium; Life (Hours): 2000Hour; Leakage Current: 110uA; Lead Diameter: 0.9mm; ESR (Equivalent Series Resistance): 180mR; REACH SVHC: No SVHC; Voltage Rating (DC): 50V; Radiation Hardening: No; Capacitance: 220uF; Length: 10.2mm; Construction: Cylindrical; Case/Package: Radial; Series: FT; Lead Free: Lead Free; Voltage Rating: 50V; Tolerance: 20%; Contact Plating: Tin; Number of Pins: 2; Height - Seated (Max): 0.413inch; RoHS Compliant: Yes; Diameter: 8mm; Ripple Current: 670mA; Lead Pitch: 3.1mm; Termination: SMD/SMT; Mount: Surface Mount; Min Operating Temperature: -55°C; Max Operating Temperature: 105°C; Voltage: 50V; Height: 10.2mm; Package Quantity: 500; Packaging: Tape and Reel
D4-D7 = CMP-08971-000008-1: DIODE SCHOTTKY 20V 5A PMDTM; Manufacturer: Rohm; Max Surge Forward Current: 100A; Max Junction Temp: +125°C; Max Repetitive Reverse Voltage: 25V; Peak Reverse Current: 500uA; Automotive: No; Digikey Description: DIODE SCHOTTKY 20V 5A PMDTM; Temperature Range High: +125°C; Height: 1.05mm; Octopart: https://octopart.com/rsx501lam20tr-rohm-82270774; Lead Free: Yes; ComponentLink2URL: https://fscdn.rohm.com/en/products/databook/datasheet/discrete/diode/schottky_barrier/rsx501lam20tr-e.pdf; Device Class L2: Diodes; ComponentLink2Description: Datasheet; Device Class L1: Discrete Semiconductors; RoHS: TRUE; Reverse Voltage: 20V; Package: PMDTM; Category: Diode; Temperature: to +125°C; Device Class L3: Schottky Diodes; Manufacturer Part Number: RSX501LAM20TR; Forward Current: 5A
L2 L3 = CMP-0227-00798-1: SMD-Power Inductor WE-PD4, L = 4.70 µH; Inductance: 4.70 ÂµH; PackageReference: WE-PD4-L; ComponentLink2Description: Datasheet; ComponentLink1URL: http://www.we-online.com; DatasheetVersion: ver 2, Sep-2006; ComponentLink2URL: http://www.we-online.de/katalog/media/pdf/74456047.pdf; PackageVersion: 2006; PackageDescription: SMD Inductor, 2-Leads, Body 12.7 x 10.0 mm; ComponentLink1Description: Manufacturer Link
U7 U8 = CMP-0069-00304-3: IC REG BUCK 5V 5A TO263-7; Efficiency: 90%; Number of Outputs: 1; Max Input Voltage: 42V; Min Input Voltage: 4.5V; Frequency: 500kHz; Min Supply Voltage: 8V; Output Type: Fixed; Quiescent Current: 3.4mA; Synchronous Rectifier: No; Output Current: 5A; Number of Pins: 7; REACH SVHC: No SVHC; Contact Plating: Tin; Max Operating Temperature: 125°C; Series: SIMPLE SWITCHER®; RoHS Compliant: Yes; Case/Package: TO-263; Max Supply Voltage: 42V; Output Voltage: 5V; Max Output Current: 5A; Height: 2mm; Package Quantity: 250; Max Output Voltage: 5V; Radiation Hardening: No; Width: 9.85mm; Mount: Surface Mount; Length: 10.16mm; Packaging: Cut Tape; Min Operating Temperature: -40°C; Switching Frequency: 500kHz; Termination: SMD/SMT; Nominal Output Voltage: 5V; Lead Free: Lead Free

## Nets that join several sheets
5V_BUS_REGULATOR: LightLinkV2 (8 pins), MOSFETs_V2 (U5.4 U6.4 U9.4), 5V_regulator_V2 (D4.1 D6.1)
GND: LightLinkV2 (12 pins), MOSFETs_V2 (15 pins), MOSFET_schematic/Designator (R21_Designator10.2), MOSFET_schematic/Designator (R21_Designator9.2), MOSFET_schematic/Designator (R21_Designator8.2), MOSFET_schematic/Designator (R21_Designator7.2), MOSFET_schematic/Designator (R21_Designator6.2), MOSFET_schematic/Designator (R21_Designator5.2), MOSFET_schematic/Designator (R21_Designator4.2), MOSFET_schematic/Designator (R21_Designator3.2), MOSFET_schematic/Designator (R21_Designator2.2), MOSFET_schematic/Designator (R21_Designator1.2), MOSFET_schematic/Designator (R21_Designator11.2), MOSFET_schematic/Designator (R21_Designator12.2), 5V_regulator_V2 (8 pins)
V_IN_REGULATOR: LightLinkV2 (J3.1 J3.2), MOSFET_schematic/Designator (Q1_Designator10.3 Q2_Designator10.3), MOSFET_schematic/Designator (Q1_Designator9.3 Q2_Designator9.3), MOSFET_schematic/Designator (Q1_Designator8.3 Q2_Designator8.3), MOSFET_schematic/Designator (Q1_Designator7.3 Q2_Designator7.3), MOSFET_schematic/Designator (Q1_Designator6.3 Q2_Designator6.3), MOSFET_schematic/Designator (Q1_Designator5.3 Q2_Designator5.3), MOSFET_schematic/Designator (Q1_Designator4.3 Q2_Designator4.3), MOSFET_schematic/Designator (Q1_Designator3.3 Q2_Designator3.3), MOSFET_schematic/Designator (Q1_Designator2.3 Q2_Designator2.3), MOSFET_schematic/Designator (Q1_Designator1.3 Q2_Designator1.3), MOSFET_schematic/Designator (Q1_Designator11.3 Q2_Designator11.3), MOSFET_schematic/Designator (Q1_Designator12.3 Q2_Designator12.3), 5V_regulator_V2 (U7.2 U8.2)
DIAG_1: LightLinkV2 (U3.A0 U4.A0), MOSFETs_V2 (R11.2 U5.1)
DIAG_2: LightLinkV2 (U3.A1 U4.A1), MOSFETs_V2 (R13.2 U5.7)
DIAG_3: LightLinkV2 (U3.A2 U4.A2), MOSFETs_V2 (R15.2 U5.8)
DIAG_4: LightLinkV2 (U3.A3 U4.A3), MOSFETs_V2 (R17.2 U5.14)
DIAG_5: LightLinkV2 (U3.A4 U4.A4), MOSFETs_V2 (R12.2 U6.1)
DIAG_6: LightLinkV2 (U3.A5 U4.A5), MOSFETs_V2 (R14.2 U6.7)
DIAG_7: LightLinkV2 (U3.A6 U4.A6), MOSFETs_V2 (R16.2 U6.8)
DIAG_8: LightLinkV2 (U3.A7 U4.A7), MOSFETs_V2 (R18.2 U6.14)
DIAG_9: LightLinkV2 (U3.A8 U4.A8), MOSFETs_V2 (R1.2 U9.1)
DIAG_10: LightLinkV2 (U3.A9 U4.A9), MOSFETs_V2 (R2.2 U9.7)
NetR1_1: MOSFETs_V2 (R1.1 U9.2), MOSFET_schematic/Designator (R20_Designator2.2 R22_Designator2.2)
NetR2_1: MOSFETs_V2 (R2.1 U9.6), MOSFET_schematic/Designator (R20_Designator1.2 R22_Designator1.2)
NetR7_1: MOSFETs_V2 (R7.1 U9.9), MOSFET_schematic/Designator (R20_Designator11.2 R22_Designator11.2)
NetR8_1: MOSFETs_V2 (R8.1 U9.13), MOSFET_schematic/Designator (R20_Designator12.2 R22_Designator12.2)
NetR11_1: MOSFETs_V2 (R11.1 U5.2), MOSFET_schematic/Designator (R20_Designator10.2 R22_Designator10.2)
NetR12_1: MOSFETs_V2 (R12.1 U6.2), MOSFET_schematic/Designator (R20_Designator6.2 R22_Designator6.2)
NetR13_1: MOSFETs_V2 (R13.1 U5.6), MOSFET_schematic/Designator (R20_Designator9.2 R22_Designator9.2)
NetR14_1: MOSFETs_V2 (R14.1 U6.6), MOSFET_schematic/Designator (R20_Designator5.2 R22_Designator5.2)
NetR15_1: MOSFETs_V2 (R15.1 U5.9), MOSFET_schematic/Designator (R20_Designator8.2 R22_Designator8.2)
NetR16_1: MOSFETs_V2 (R16.1 U6.9), MOSFET_schematic/Designator (R20_Designator4.2 R22_Designator4.2)
NetR17_1: MOSFETs_V2 (R17.1 U5.13), MOSFET_schematic/Designator (R20_Designator7.2 R22_Designator7.2)
NetR18_1: MOSFETs_V2 (R18.1 U6.13), MOSFET_schematic/Designator (R20_Designator3.2 R22_Designator3.2)
OUT_1: LightLinkV2 (J1.1), MOSFET_schematic/Designator (D2_Designator10.1 D3_Designator10.1)
OUT_2: LightLinkV2 (J1.2), MOSFET_schematic/Designator (D2_Designator9.1 D3_Designator9.1)
OUT_3: LightLinkV2 (J1.3), MOSFET_schematic/Designator (D2_Designator8.1 D3_Designator8.1)
OUT_4: LightLinkV2 (J1.4), MOSFET_schematic/Designator (D2_Designator7.1 D3_Designator7.1)
OUT_5: LightLinkV2 (J1.5), MOSFET_schematic/Designator (D2_Designator6.1 D3_Designator6.1)
OUT_6: LightLinkV2 (J1.6), MOSFET_schematic/Designator (D2_Designator5.1 D3_Designator5.1)
OUT_7: LightLinkV2 (J2.1), MOSFET_schematic/Designator (D2_Designator4.1 D3_Designator4.1)
OUT_8: LightLinkV2 (J2.2), MOSFET_schematic/Designator (D2_Designator3.1 D3_Designator3.1)
OUT_9: LightLinkV2 (J2.3), MOSFET_schematic/Designator (D2_Designator2.1 D3_Designator2.1)
OUT_10: LightLinkV2 (J2.4), MOSFET_schematic/Designator (D2_Designator1.1 D3_Designator1.1)
P_SENSE_1: LightLinkV2 (U3.A10 U4.A10), 5V_regulator_V2 (C4.2 D4.2 L2.2 U7.6)
P_SENSE_2: LightLinkV2 (U3.A11 U4.A11), 5V_regulator_V2 (C6.2 D6.2 L3.2 U8.6)
TRIG_1: LightLinkV2 (U3.D2 U4.D2), MOSFET_schematic/Designator (R19_Designator10.1 R21_Designator10.1)
TRIG_2: LightLinkV2 (U3.D3 U4.D3), MOSFET_schematic/Designator (R19_Designator9.1 R21_Designator9.1)
TRIG_3: LightLinkV2 (U3.D4 U4.D4), MOSFET_schematic/Designator (R19_Designator8.1 R21_Designator8.1)
TRIG_4: LightLinkV2 (U3.D5 U4.D5), MOSFET_schematic/Designator (R19_Designator7.1 R21_Designator7.1)
TRIG_5: LightLinkV2 (U3.D6 U4.D6), MOSFET_schematic/Designator (R19_Designator6.1 R21_Designator6.1)
TRIG_6: LightLinkV2 (U3.D7 U4.D7), MOSFET_schematic/Designator (R19_Designator5.1 R21_Designator5.1)
TRIG_7: LightLinkV2 (U3.D8 U4.D8), MOSFET_schematic/Designator (R19_Designator4.1 R21_Designator4.1)
TRIG_8: LightLinkV2 (U3.D9 U4.D9), MOSFET_schematic/Designator (R19_Designator3.1 R21_Designator3.1)
TRIG_9: LightLinkV2 (U3.D10 U4.D10), MOSFET_schematic/Designator (R19_Designator2.1 R21_Designator2.1)
TRIG_10: LightLinkV2 (U3.D11 U4.D11), MOSFET_schematic/Designator (R19_Designator1.1 R21_Designator1.1)